# EAGLE design ArduOSD_Simple2222 (EAGLE 6.3)
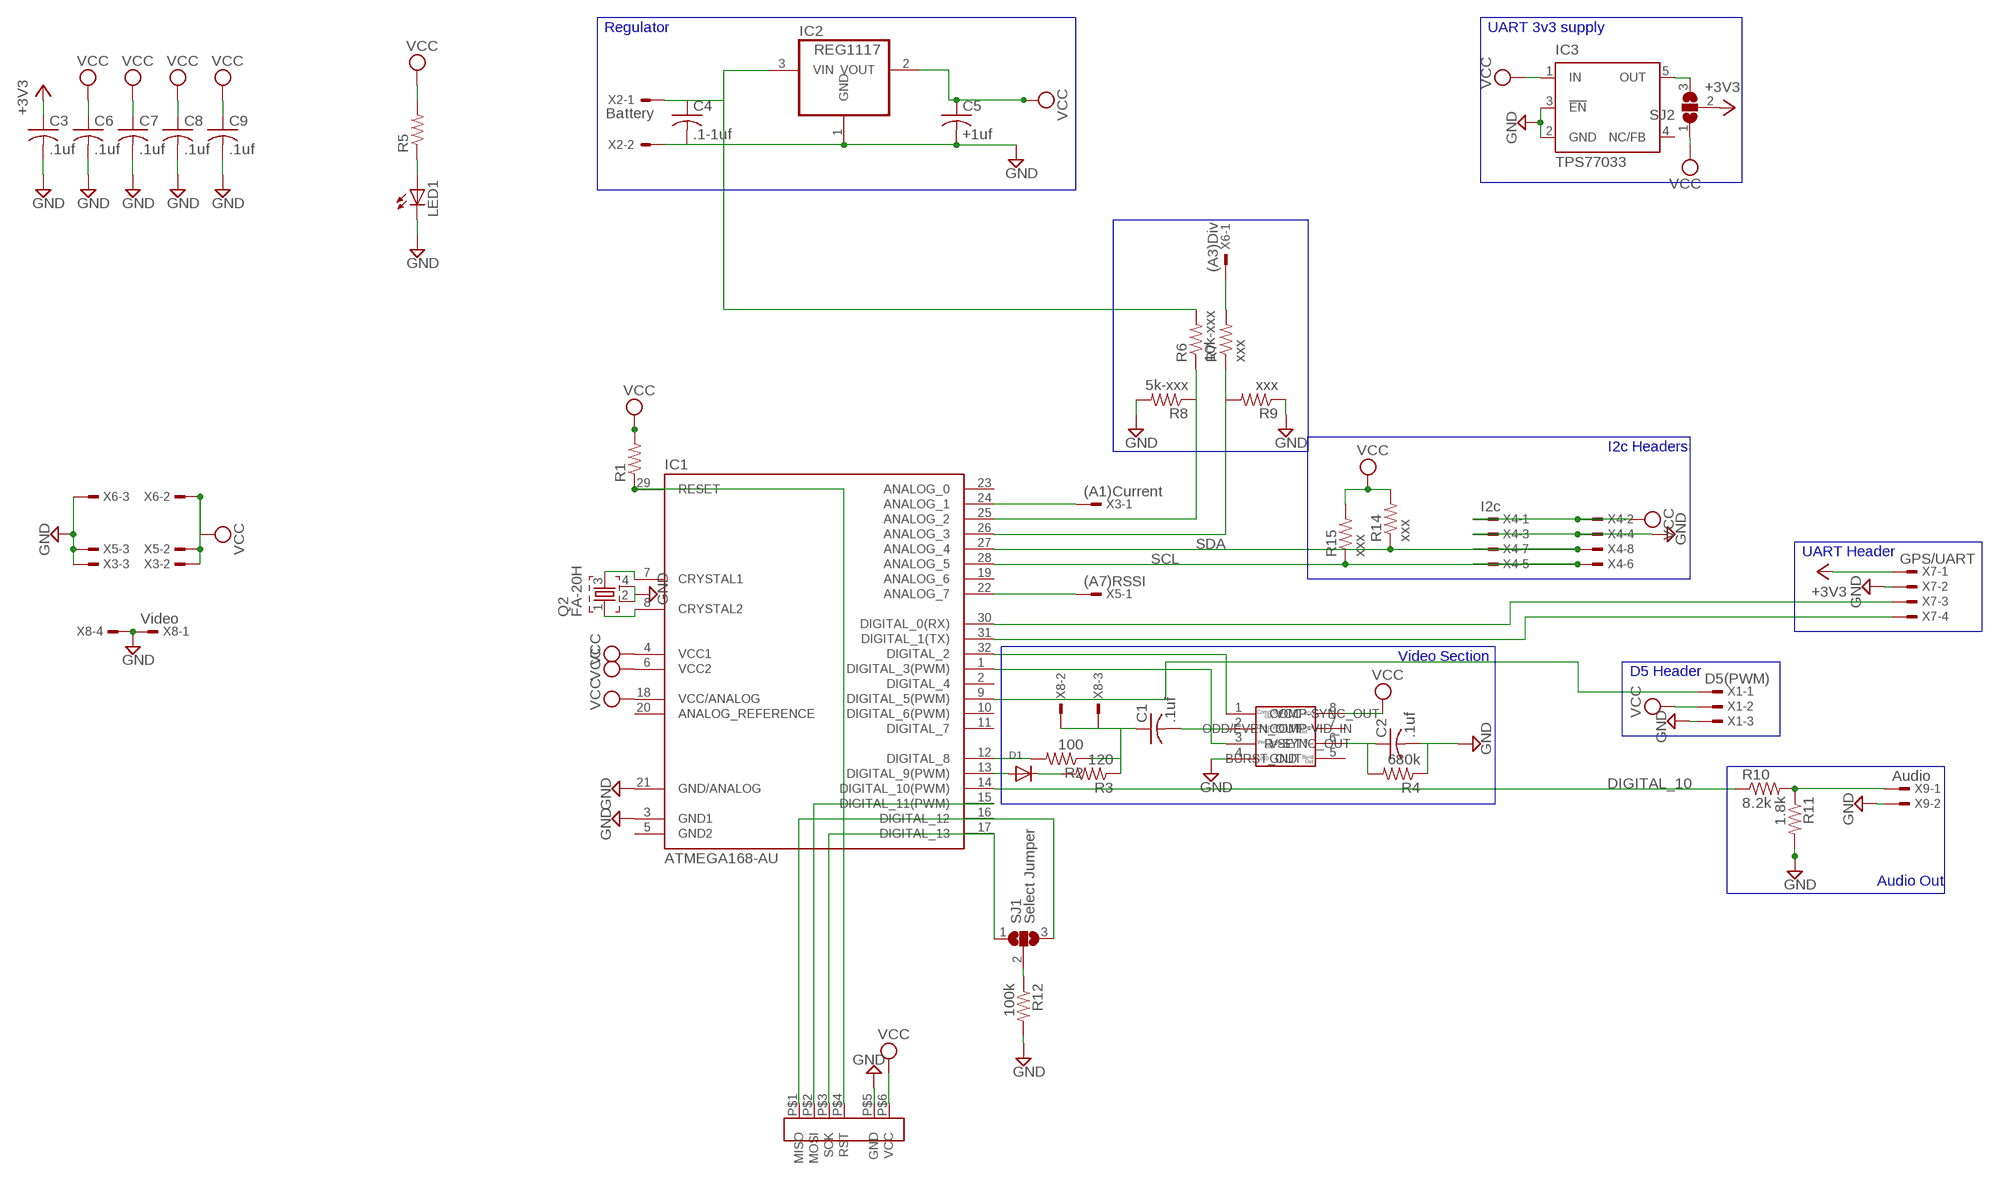
[diagram p0: schematic, sheet 1]

## Parts
C1  .1uf  C-USC0805K  [C0805K]
C2  .1uf  C-USC0805K  [C0805K]
C3  .1uf  C-USC0805K  [C0805K]
C4  .1-1uf  C-USC0805K  [C0805K]
C5  +1uf  C-USC0805K  [C0805K]
C6  .1uf  C-USC0805K  [C0805K]
C7  .1uf  C-USC0805K  [C0805K]
C8  .1uf  C-USC0805K  [C0805K]
C9  .1uf  C-USC0805K  [C0805K]
D1  DIODESOT23_WAVE  [SOT23-W]
IC1  ATMEGA168-AU  [TQFP32-08]
IC2  REG1117  [SOT223]
IC3  TPS77033  [SOT23-DBV]
LED1  LEDCHIP-LED0805  [CHIP-LED0805]
LM1881  LM1881SO08  [SO08]
Q2  FA-20H  [FA-20H]
R1  R-US_R0805  [R0805]
R2  100  R-US_R0805  [R0805]
R3  120  R-US_R0805  [R0805]
R4  680k  R-US_R0805  [R0805]
R5  R-US_R0805  [R0805]
R6  10k-xxx  R-US_R0805  [R0805]
R7  xxx  R-US_R0805  [R0805]
R8  5k-xxx  R-US_R0805  [R0805]
R9  xxx  R-US_R0805  [R0805]
R10  8.2k  R-US_R0805  [R0805]
R11  1.8k  R-US_R0805  [R0805]
R12  100k  R-US_R0805  [R0805]
R14  xxx  R-US_R0805  [R0805]
R15  xxx  R-US_R0805  [R0805]
SJ1  Select Jumper  SJ2W  [SJ_2]
SJ2  SJ2W  [SJ_2]
U$1  LIN_ISP  [LINEAR_ISP]
X1  D5(PWM)  TSW-103-02-S-S  [TSW-103-02-S-S]
X2  Battery  22-23-2021  [22-23-2021]
X3  (A1)Current  TSW-103-02-S-S  [TSW-103-02-S-S]
X4  I2c  TSW-104-02-S-D-RA  [TSW-104-02-S-D-RA]
X5  (A7)RSSI  TSW-103-02-S-S  [TSW-103-02-S-S]
X6  (A3)Div  TSW-103-02-S-S  [TSW-103-02-S-S]
X7  GPS/UART  TSW-104-02-S-S-RA  [TSW-104-02-S-S-RA]
X8  Video  TSW-104-02-S-S-RA  [TSW-104-02-S-S-RA]
X9  Audio  TSW-102-02-S-S-RA  [TSW-102-02-S-S-RA]

## Nets
+3V3: C3.1 SJ2.2 X7.1
AAAAAAAAAAAAHHHHHHHHHHHHH: R10.2 R11.1 X9.1
BATT_FPV: C4.1 IC2.3(VIN) R6.2 X2.1
DIGITAL_10: IC1.14(DIGITAL_10(PWM)) R10.1
GND: C2.2 C3.2 C4.2 C5.2 C6.2 C7.2 C8.2 C9.2 IC1.3(GND1) IC1.21(GND/ANALOG) IC2.1(GND) IC3.2(GND) IC3.3(!EN) LED1.C LM1881.4(GND) Q2.2 Q2.4 R4.1 R8.2 R9.1 R11.2 R12.2 U$1.P$5(GND) X1.3 X2.2 X3.3 X4.3 X4.4 X5.3 X6.3 X7.2 X8.1 X8.4 X9.2
N$1: IC1.29(RESET) R1.1 U$1.P$4(RST)
N$2: IC1.15(DIGITAL_11(PWM)) U$1.P$2(MOSI)
N$3: IC1.32(DIGITAL_2) LM1881.1(COMP-SYNC_OUT)
N$4: IC1.1(DIGITAL_3(PWM)) LM1881.3(V-SYNC_OUT)
N$5: C1.2 LM1881.2(COMP-VID_IN)
N$7: IC1.12(DIGITAL_8) R2.2
N$8: D1.3(C) R3.2
N$10: IC1.26(ANALOG_3) R7.1 R9.2
N$11: IC1.7(CRYSTAL1) Q2.3
N$12: R12.1 SJ1.2
N$13: R7.2 X6.1
N$14: IC1.22(ANALOG_7) X5.1
N$15: IC1.16(DIGITAL_12) SJ1.3 U$1.P$1(MISO)
N$16: IC1.17(DIGITAL_13) SJ1.1 U$1.P$3(SCK)
N$17: IC1.24(ANALOG_1) X3.1
N$18: D1.1(A) IC1.13(DIGITAL_9(PWM))
N$19: IC1.25(ANALOG_2) R6.1 R8.1
N$20: LED1.A R5.1
N$21: IC1.9(DIGITAL_5(PWM)) X1.1
N$23: C1.1 R2.1 R3.1 X8.2 X8.3
N$24: IC1.8(CRYSTAL2) Q2.1
N$25: C2.1 LM1881.6(R-SET) R4.2
N$26: IC3.5(OUT) SJ2.3
RX: IC1.30(DIGITAL_0(RX)) X7.3
SCL: IC1.28(ANALOG_5) R15.1 X4.5 X4.6
SDA: IC1.27(ANALOG_4) R14.1 X4.7 X4.8
TX: IC1.31(DIGITAL_1(TX)) X7.4
VCC: C5.1 C6.1 C7.1 C8.1 C9.1 IC1.4(VCC1) IC1.6(VCC2) IC1.18(VCC/ANALOG) IC2.2(VOUT) IC3.1(IN) LM1881.8(VCC) R1.2 R5.2 R14.2 R15.2 SJ2.1 U$1.P$6(VCC) X1.2 X3.2 X4.1 X4.2 X5.2 X6.2
Unconnected: IC1.2(DIGITAL_4) IC1.10(DIGITAL_6(PWM)) IC1.11(DIGITAL_7) IC1.19(ANALOG_6) IC1.20(ANALOG_REFERENCE) IC1.23(ANALOG_0) IC3.4(NC/FB) LM1881.5(BURST_OUT) LM1881.7(ODD/EVEN_OUT)

## Buses
B$1
B$2
B$3
B$4
B$5
B$7
B$8
B$9

## Notes on the sheet
- Regulator | UART 3v3 supply
- I2c Headers
- UART Header
- Video Section
- D5 Header
- Audio Out

## Power pins joined to a net without a drawn wire
GND2: IC1.5(GND2)

## Library data of the parts
C1-C9 = adafruit:C-US: CAPACITOR, American symbol
D1 = adafruit:DIODE: Diode SMADIODE - SMA Surface Mount Package 20V 1A Schottky Diode Digikey: 641-1014-6-ND DO-1N4148 - Through Hole Small Current Diode SOD-123 20V 1 A (.5mV Vf) Schottky Diode - Digikey: MBRX120TPMSCT-ND SOD-323 10V 570mA (.38mV Vf, 3ns) Schottky Diode - Digikey: ZLLS410CT-ND SOD-523 30V 30mA Schottky Diode (RB751S-40TE61) - Digikey: RB751S-40TE61CT-ND SOT23-R/W - SOT23 Package (R = Solder Paste/Reflow Ovens, W = Hand-Soldering) BAT54Film 40V 300mA - Digikey: 497-7162-1-ND
IC1 = Arduino-AVR:ATMEGA168
IC2 = burr-brown:REG1117: 800mA and 1A Low Dropout (LDO) Positive Regulator 1.8V, 2.5V, 2.85V, 3.3V, 5V, and Adj; MPN: REG1117; OC_FARNELL: 1097566; OC_NEWARK: 14P6981
IC3 = texas:TPS770*: ULTRALOW-POWER 50-mA LOW-DROPOUT LINEAR REGULATORS 50-mA Low-Dropout Regulator Source: http://focus.ti.com/lit/ds/symlink/tps77001.pdf; MF: TEXAS INSTRUMENTS; MPN: TPS77033DBVT; OC_FARNELL: 8461570; OC_NEWARK: 77C1187
LED1 = adafruit:LED: LED OSRAM: - CHIPLED LG R971, LG N971, LY N971, LG Q971, LY Q971, LO R971, LY R971 LH N974, LH R974 LS Q976, LO Q976, LY Q976 LO Q996 - Hyper CHIPLED LW Q18S LB Q993, LB Q99A, LB R99A - SideLED LS A670, LO A670, LY A670, LG A670, LP A670 LB A673, LV A673, LT A673, LW A673 LH A674 LY A675 LS A676, LA A676, LO A676, LY A676, LW A676 LS A679, LY A679, LG A679 - Hyper Micro SIDELED® LS Y876, LA Y876, LO Y876, LY Y876 LT Y87S - SmartLED LW L88C, LW L88S LB L89C, LB L89S, LG L890 LS L89K, LO L89K, LY L89K LS L896, LA L896, LO L896, LY L896 - TOPLED LS T670, LO T670, LY T670, LG T670, LP T670 LSG T670, LSP T670, LSY T670, LOP T670, LYG T670 LG T671, LOG T671, LSG T671 LB T673, LV T673, LT T673, LW T673 LH T674 LS T676, LA T676, LO T676, LY T676, LB T676, LH T676, LSB T676, LW T676 LB T67C, LV T67C, LT T67C, LS T67K, LO T67K, LY T67K, LW E67C LS E67B, LA E67B, LO E67B, LY E67B, LB E67C, LV E67C, LT E67C LW T67C LS T679, LY T679, LG T679 LS T770, LO T770, LY T770, LG T770, LP T770 LB T773, LV T773, LT T773, LW T773 LH T774 LS E675, LA E675, LY E675, LS T675 LS T776, LA T776, LO T776, LY T776, LB T776 LHGB T686 LT T68C, LB T68C - Hyper Mini TOPLED® LB M676 - Mini TOPLED Santana® LG M470 LS M47K, LO M47K, LY M47K Source: http://www.osram.convergy.de/
LM1881 = linear:LM1881
Q2 = crystal:FA-: MHz RANGE CRYSTAL UNIT Source: Epson Toyocom
R1-R12 R14 R15 = adafruit:R-US_: RESISTOR, American symbol
SJ1 SJ2 = jumper:SJ2W: SMD solder JUMPER
U$1 = Legot:LIN_ISP: ISP or ICSP for AVR chips. 6 pin 1: Mosi 2: Miso 3: SCK 4: RST 5: GND 6: VCC
X1 X3 X5 X6 = con-samtec:TSW-103-02-S-S: THROUGH-HOLE .025" SQ POST HEADER Source: Samtec TSW.pdf; OC_FARNELL: unknown; OC_NEWARK: unknown
X2 = con-molex:22-23-2021: .100" (2.54mm) Center Header - 2 Pin; MF: MOLEX; MPN: 22-23-2021; OC_FARNELL: 1462926; OC_NEWARK: 25C3832
X4 = con-samtec:TSW-104-02-S-D: THROUGH-HOLE .025" SQ POST HEADER Source: Samtec TSW.pdf; OC_FARNELL: unknown; OC_NEWARK: unknown
X7 X8 = con-samtec:TSW-104-02-S-S: THROUGH-HOLE .025" SQ POST HEADER Source: Samtec TSW.pdf; OC_FARNELL: unknown; OC_NEWARK: unknown
X9 = con-samtec:TSW-102-02-S-S: THROUGH-HOLE .025" SQ POST HEADER Source: Samtec TSW.pdf; OC_FARNELL: unknown; OC_NEWARK: unknown

## Board
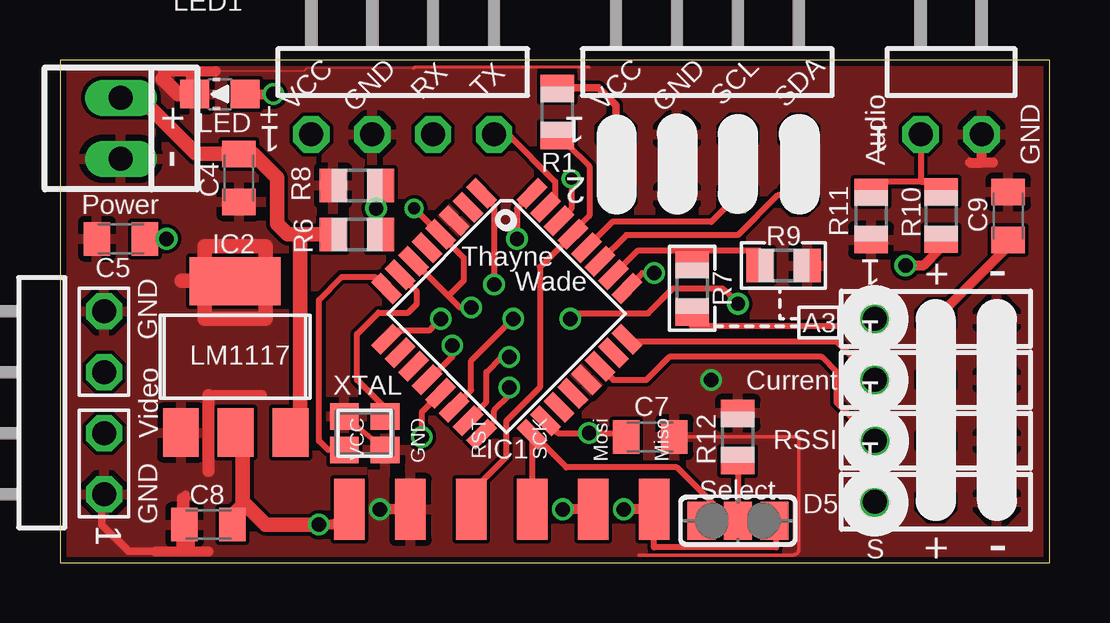
[diagram p1: board, top side]
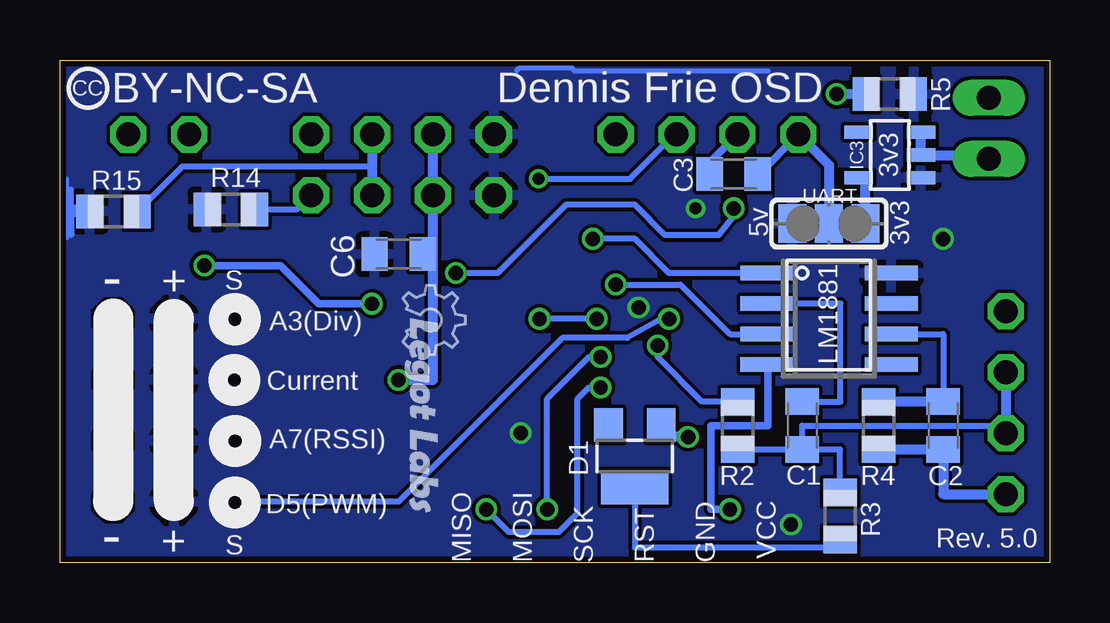
[diagram p2: board, bottom side, seen from below]

Size 41.26 x 20.95 mm. Coordinates in mm from the lower left corner, seen from the top.
Outline: 0,0 41.26,0 41.26,20.95 0,20.95 0,0
Copper layers (1*16): Top 0.035mm / dielectric 1.5mm / Bottom 0.035mm
Design rules "Fusion_eagle_rule_v1.1": minimum track width 6mil, minimum drill 12mil, track to track 6mil, track to pad 6mil, pad to pad 6mil, via to via 6mil, smd to smd 0mil, copper to edge 10mil, drill to drill 10mil, minimum pad ring 10mil, minimum via ring 6mil, stop-mask expansion 2mil, vias tented up to drill 100mil, thermal gap 10mil

### Footprints (pad centres in the part's own frame; a part is rotated, then mirrored left to right if it is on the bottom)
C0805K = smd 1.1 x 1.4: 1 -1,0; 2 1,0
SOT23-W = smd 1.2 x 1.4: 1 -1.1,-1.3; 2 1.1,-1.3 | smd 2.8 x 1.4: 3 0,1.3
TQFP32-08 = smd 1.27 x 0.559: 1 -4.293,2.8; 2 -4.293,2; 3 -4.293,1.2; 4 -4.293,0.4; 5 -4.293,-0.4; 6 -4.293,-1.2; 7 -4.293,-2; 8 -4.293,-2.8; 17 4.293,-2.8; 18 4.293,-2; 19 4.293,-1.2; 20 4.293,-0.4; 21 4.293,0.4; 22 4.293,1.2; 23 4.293,2; 24 4.293,2.8 | smd 0.559 x 1.27: 9 -2.8,-4.293; 10 -2,-4.293; 11 -1.2,-4.293; 12 -0.4,-4.293; 13 0.4,-4.293; 14 1.2,-4.293; 15 2,-4.293; 16 2.8,-4.293; 25 2.8,4.293; 26 2,4.293; 27 1.2,4.293; 28 0.4,4.293; 29 -0.4,4.293; 30 -1.2,4.293; 31 -2,4.293; 32 -2.8,4.293
SOT223 = smd 1.499 x 2.007: 1 -2.261,-3.15; 2 0.025,-3.15; 3 2.311,-3.15 | smd 3.81 x 2.007: 4 0,3.15
SOT23-DBV = smd 0.55 x 1.2: 1 -0.95,-1.3; 2 0,-1.3; 3 0.95,-1.3; 4 0.95,1.3; 5 -0.95,1.3
CHIP-LED0805 = smd 1.2 x 1.2: A 0,-1.05; C 0,1.05
SO08 = smd 0.6 x 2.2: 1 -1.905,-2.6; 2 -0.635,-2.6; 3 0.635,-2.6; 4 1.905,-2.6; 5 1.905,2.6; 6 0.635,2.6; 7 -0.635,2.6; 8 -1.905,2.6
FA-20H = smd 1.2 x 1.1: 1 -0.85,-0.7; 2 0.85,-0.7; 3 0.85,0.7; 4 -0.85,0.7
R0805 = smd 1.1 x 1.4: 1 -1,0; 2 1,0
SJ_2 = smd 1.168 x 1.6: 1 -1.524,0; 2 0,0; 3 1.524,0
LINEAR_ISP = smd 1.27 x 2.54: P$1 -6.35,0; P$2 -3.81,0; P$3 -1.27,0; P$4 1.27,0; P$5 3.81,0; P$6 6.35,0
TSW-103-02-S-S = drill 1 pad 1.5 octagon: 1 2.54,0; 2 0,0; 3 -2.54,0
22-23-2021 = drill 1 long: 1 -1.27,0; 2 1.27,0
TSW-104-02-S-D-RA = drill 1 pad 1.5 octagon: 1 3.81,1.524; 2 3.81,4.064; 3 1.27,1.524; 4 1.27,4.064; 5 -1.27,1.524; 6 -1.27,4.064; 7 -3.81,1.524; 8 -3.81,4.064
TSW-104-02-S-S-RA = drill 1 pad 1.5 octagon: 1 3.81,1.524; 2 1.27,1.524; 3 -1.27,1.524; 4 -3.81,1.524
TSW-102-02-S-S-RA = drill 1 pad 1.5 octagon: 1 1.27,1.524; 2 -1.27,1.524

### Placement (x,y rotation side)
C1  10.32,5.71 90 bottom
C2  4.45,5.71 270 bottom
C3  13.18,16.19 180 bottom
C4  7.46,16.03 270 top
C5  2.54,13.49 180 top
C6  27.15,12.86 0 bottom
C7  24.61,5.24 0 top
C8  6.19,1.59 180 top
C9  39.53,14.45 90 top
D1  17.3,4.45 180 bottom
IC1  18.62,10.37 315 top
IC2  7.3,8.57 0 top
IC3  6.67,16.99 90 bottom
LED1  6.67,19.53 90 top
LM1881  9.21,10.16 270 bottom
Q2  12.7,5.4 0 top
R1  20.73,18.78 90 top
R2  13.02,5.71 90 bottom
R3  8.75,1.94 270 bottom
R4  7.14,5.71 90 bottom
R5  6.67,19.53 0 bottom
R6  12.38,13.68 180 top
R7  26.35,11.43 270 top
R8  12.38,15.72 180 top
R9  30.16,12.38 180 top
R10  36.72,14.47 90 top
R11  33.81,14.45 270 top
R12  28.26,5.24 90 top
R14  34.15,14.72 180 bottom
R15  39.03,14.64 180 bottom
SJ1  28.26,1.75 0 top
SJ2  9.21,14.13 0 bottom
U$1  18.41,2.22 180 top
X1  36.51,2.54 180 top
X2  2.54,18.1 270 top
X3  36.51,7.62 180 top
X4  26.99,19.37 180 top
X5  36.51,5.08 180 top
X6  36.51,10.16 180 top
X7  14.29,19.37 180 top
X8  0.32,6.67 270 top
X9  37.15,19.37 180 top

### Tracks (layer width: path | path; a pad name or v marks a point on that pad's centre or on a via)
+3V3
  Bottom 0.305: 10.53,17.84 X7.1 12.13,16.19 C3.1
  Bottom 0.406: X7.1 9.21,16.57 SJ2.2
AAAAAAAAAAAAHHHHHHHHHHHHH
  Top 0.254: 36.23,15.76 R10.2 36.72,15.88 35.88,15.88 | X9.1 35.88,15.88 | 35.88,15.88 34.13,15.88 34.13,15.45 R11.1
BATT_FPV
  Top 0.508: X2.1 3.33,19.37
  Top 0.61: IC2.3 10,4.86 10,13.68 | 10,13.68 9.5,13.68 9.05,14.13 9.05,16.03 8.05,17.03 C4.1 5.67,17.03 3.33,19.37 | 10,13.68 R6.2
DIGITAL_10  (via drill 0.6)
  Top 0.254: v21.27,10.16 21.5,10.38 24.51,10.38 25.56,11.43 27.62,11.43 27.94,11.11 v28.26,10.79 28.26,10.71 | IC1.14 17.14,7.19 17.14,8.41 v18.89,10.16
  Top 0.406: R10.1 36.67,13.47 36.67,13.07 35.98,12.38 v35.24,12.38
  Bottom 0.254: v18.89,10.16 v21.27,10.16
  Bottom 0.305: v28.26,10.79 30.47,10.79 32.07,12.38 v35.24,12.38
GND  (via drill 0.6)
  Top 0: 14.73,20.6 10.28,20.6 10.16,20.48 6.51,20.48
  Top 0.127: 22.07,20.64 14.82,20.64 arc45 14.73,20.6
  Top 0.152: 24.13,0.32 30.54,0.32 arc90 30.8,0.57 30.8,5.24 C7.2
  Top 0.203: Q2.2 Q2.4
  Top 0.254: IC1.21 21.94,7.59
  Top 0.305: 5.08,2.7 5.24,2.86 5.24,0.48 2.86,0.48 1.75,1.59 1.75,2.7 1.91,2.86
  Top 0.406: U$1.P$5 v13.34,2.22 | 5.24,2.7 5.08,2.7 5.08,1.43 | 5.08,1.43 5.08,0.64 5.4,0.64 5.4,1.59 5.24,1.59 | 5.08,1.43 5.24,1.59 | 3.97,0.48 5.24,0.48 | 5.24,0.48 6.19,0.48 | 5.24,1.59 5.24,0.48 | 38.89,16.67 38.42,16.67 | 37.94,16.67 38.42,16.67 | 38.42,16.67 38.42,17.94 | 8.41,6.99 6.51,6.99 arc90 6.19,6.67 6.19,3.81 | 4.29,20.48 6.51,20.48
  Top 0.508: 6.19,3.81 6.19,6.99
  Top 0.61: 5.08,11.75 6.03,11.75 | 6.03,11.75 6.03,13.18 8.57,13.18 8.57,10.16 6.03,10.16 6.03,11.75 | 4.29,20.16 4.92,19.53 5.56,19.53 5.56,20.32
  Bottom 0.254: 11.81,5.71 11.75,5.71 | 11.75,8.26 LM1881.4
  Bottom 0.305: v13.34,2.22 14.13,2.22 14.13,5.71 11.81,5.71 | 11.75,5.71 11.75,8.26 | C3.2 14.18,16.68 X7.2
  Bottom 0.406: v27.15,7.62 25.72,7.62 25.72,13.18 | 25.72,13.18 X4.3 | R4.1 C2.2 4.45,2.86 X8.1 | C6.2 25.72,13.18 | IC3.2 IC3.3 5.4,17.94 5.4,16.99 2.54,16.99 X2.2
  pour Top: 0.32,20.64 40.96,20.64 40.96,0.32 0.32,0.32
N$1
  Top 0.254: 17.14,2.94 18.59,4.39 18.59,5.89 20,7.3 20,12.31 IC1.29 21.38,13.76 22.07,14.45 22.07,16.51 21.16,17.41 20.64,17.41 R1.1
  Top 0.406: U$1.P$4 17.14,2.94
N$2  (via drill 0.6)
  Top 0.254: IC1.15 17.78,6.7 17.78,7.94 18.41,8.57 v18.73,8.57
  Top 0.406: U$1.P$2 v20.95,2.22
  Bottom 0.254: v20.95,2.22 20.95,6.83 19.21,8.57 v18.73,8.57
N$3  (via drill 0.6)
  Top 0.254: IC1.32 19.05,14.76 v19.05,13.49
  Bottom 0.254: LM1881.1 15.88,12.06 17.3,13.49 v19.05,13.49
N$4  (via drill 0.6)
  Top 0.254: IC1.1 18.1,14.85 v18.1,11.59
  Bottom 0.254: v18.1,11.59 15.4,11.59 13.34,9.53 LM1881.3
N$5
  Bottom 0.254: C1.2 8.73,6.71 8.73,10.79 LM1881.2
N$7  (via drill 0.6)
  Top 0.254: IC1.12 15.39,7.62 16.35,8.57 v16.35,9.05
  Bottom 0.254: R2.2 14.49,6.71 16.35,8.57 v16.35,9.05
N$8
  Bottom 0.254: D1.3 17.3,0.64 8.68,0.64
  Bottom 0.406: 8.68,0.64 8.68,0.91 R3.2
N$10
  Top 0.254: 29.21,12.38 29.42,12.34 R9.2 29.16,13.02 26.35,13.02 | R7.1 26.4,12.38 26.35,12.38 R7.1 | IC1.26 24.1,13.02 26.35,13.02 | 26.3,12.43 R7.1 | 26.35,13.02 R7.1
N$11
  Top 0.254: Q2.3 13.55,6.45 12.38,7.62 12.38,9.53 13.27,10.42 14.52,10.42 14.88,10.78 14.88,11.29 IC1.7
N$12
  Top 0.254: R12.1 SJ1.2
N$13
  Top 0.254: X6.1 33.66,9.84 26.35,9.84 R7.2
N$14
  Top 0.254: X5.1 32.38,6.67 32.38,7.94 31.75,8.57 25.4,8.57 24.45,7.62 23.07,7.62 IC1.22
N$15  (via drill 0.6)
  Top 0.254: IC1.16 18.1,5.88 18.1,6.35 18.73,6.99 v18.73,7.3 | SJ1.3 29.84,2.16 29.84,0.64 24.77,0.64 U$1.P$1
  Top 0.406: U$1.P$1 v23.5,2.22
  Bottom 0.254: v18.73,7.3 19.21,7.3 19.68,6.83 19.68,2.06 20.48,1.27 22.54,1.27 v23.5,2.22
N$16
  Top 0.254: U$1.P$3 IC1.17 19.68,5.4 21.11,3.97 25.72,3.97 27.15,2.54 26.83,2.32 SJ1.1
  Top 0.406: U$1.P$3
N$17
  Top 0.254: X3.1 32.38,9.21 23.81,9.21 23.6,9.31 IC1.24
N$18  (via drill 0.6)
  Top 0.254: IC1.13 15.08,6.26 v15.08,5.24
  Bottom 0.406: v15.08,5.24 16.2,5.24 D1.1
N$19  (via drill 0.6)
  Top 0.254: IC1.25 24.28,12.06 v24.77,12.06
  Top 0.61: R6.1 13.38,13.81 13.18,13.81 v13.18,14.76 13.18,15.72 R8.1
  Bottom 0.254: v13.18,14.76 13.18,14.45 13.81,13.65 16.03,13.65 17.3,14.92 20.16,14.92 23.02,12.06 v24.77,12.06
N$20  (via drill 0.6)
  Top 0.406: LED1.A v8.89,19.53
  Bottom 0.406: R5.1 v8.89,19.53
N$21  (via drill 0.6)
  Top 0.254: IC1.9 13.98,9.68 15.4,9.68 v15.88,10.16
  Bottom 0.254: X1.1 27.15,2.54 20.32,9.37 17.62,9.37 16.19,10.16 v15.88,10.16
N$23
  Bottom 0.254: C1.1 R2.1 | C1.1 10.32,5.71 2.22,5.71 | 2.22,5.4 X8.2 | 8.89,4.71 C1.1 | R3.1 8.74,4.72 C1.1
  Bottom 0.406: X8.3 X8.2 | 2.22,5.71 2.22,5.4
N$24
  Top 0.254: Q2.1 11.18,4.7 10.79,5.08 10.79,10.95 11.75,11.91 13.13,11.91 IC1.8
N$25
  Bottom 0.254: LM1881.6 4.45,9.53 C2.1
  Bottom 0.406: C2.1 R4.2
N$26
  Bottom 0.406: SJ2.3 7.68,16.04 IC3.5
RX  (via drill 0.5)
  Top 0.254: v21.31,16 21.31,14.76 IC1.30
  Bottom 0.254: v21.31,16 17.5,16 15.72,17.78 15.62,17.78 X7.3
SCL
  Top 0.254: X4.6 27.16,14.2 23.02,14.2 IC1.28
  Bottom 0.254: R15.1 36.16,16.51 28.26,16.51
  Bottom 0.406: X4.5 28.26,16.51 X4.6
SDA
  Top 0.254: IC1.27 23.61,13.65 28.26,13.65 29.91,15.3 X4.8
  Top 0.406: X4.8 X4.7
  Bottom 0.254: R14.1 31.38,14.72 X4.8
TX
  Top 0.254: X7.4 18.67,17.84 20.64,15.88 20.64,15.21 IC1.31
VCC  (via drill 0.5, 0.6)
  Top 0.254: v17.14,10.64 16.67,10.63 IC1.6 16.18,11.11 16.19,11.11 16.83,11.75 16.83,12.7 15.87,13.66 IC1.4 15.84,13.69 v14.76,14.76 | IC1.18 20.77,5.4 v22.05,5.4 | 22.07,5.4 23.61,5.4 C7.1
  Top 0.305: R1.2 22.45,19.78 23.18,19.05 X4.1
  Top 0.406: U$1.P$6 11.43,1.59 v10.79,1.59 | C8.1 7.1,2.02 7.62,2.54 | C9.1 39.8,13.45 X6.2
  Top 0.508: 22.07,5.4 v22.05,5.4
  Top 0.61: IC2.2 7.62,5.29 7.62,2.54 8.57,1.59 v10.79,1.59 | C5.1 v4.45,13.49
  Bottom 0.127: 40.96,16.03 40.96,14.45 | 40.96,14.45 40.96,13.49 | 39.85,14.45 40.8,14.45 40.96,14.45
  Bottom 0.2: 11.75,20.48 19.76,20.48 arc90 19.88,20.6 22.11,20.6 arc-90 22.23,20.48
  Bottom 0.254: 40.8,15.56 40.8,14.45 40.8,13.65
  Bottom 0.305: 40.01,14.76 40.8,14.76 40.8,14.61 39.85,14.61 39.85,14.45
  pour Bottom: 0.32,20.64 40.96,20.64 40.96,0.32 0.32,0.32

### Text on the board
tNames: VCC | GND | RX | TX | VCC | GND | SCL | SDA | + | LED | Audio | GND | - | Power | Thayne | Wade | + | - | A3 | GND | LM1117 | XTAL | Current | RSSI | Video | Select | GND | D5 | C:/Program Files (x86)/EAGLE_PCB/Legot Labs-Open Source BITMAP.bmp | S | + | -
bNames: Dennis Frie OSD | BY-NC-SA | CC | 3v3 | IC3 | UART | 5v | 3v3 | S | + | - | A3(Div) | Current | A7(RSSI) | D5(PWM) | Rev. 5.0 | VCC | GND | RST | SCK | MOSI | MISO | S | + | -